# Altium schematic sheet Sensors_lib.SchDoc
size A
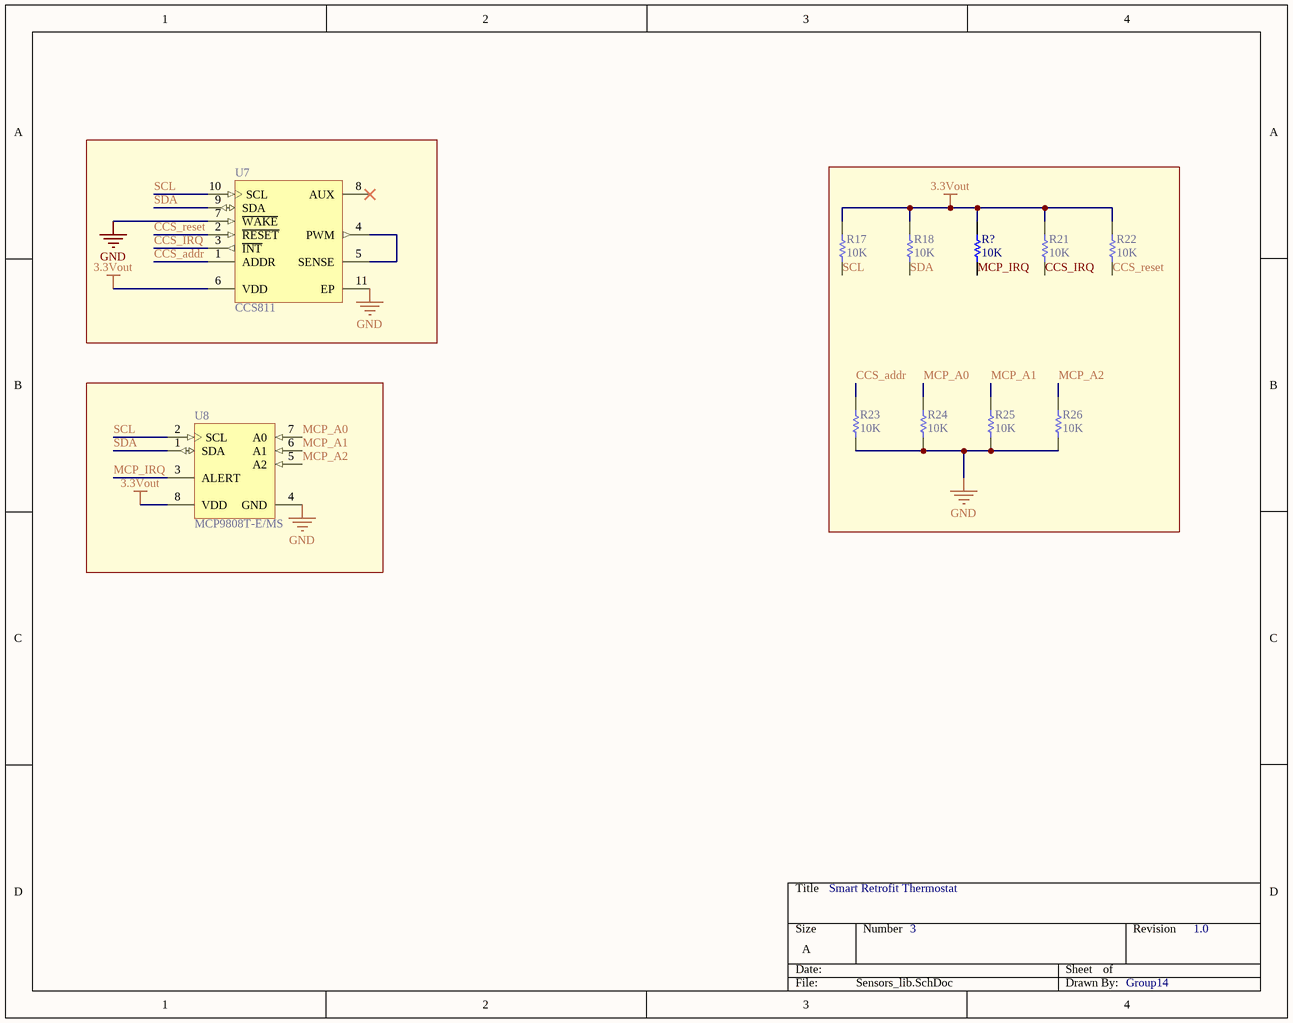
[diagram p0: Sensors_lib.SchDoc]

## Parts
R17  10K  [RESC0805(2012)_M]
R18  10K  [RESC0805(2012)_M]
R21  10K  [RESC0805(2012)_M]
R22  10K  [RESC0805(2012)_M]
R23  10K  [RESC0805(2012)_M]
R24  10K  [RESC0805(2012)_M]
R25  10K  [RESC0805(2012)_M]
R26  10K  [RESC0805(2012)_M]
R?  10K  [RESC0805(2012)_M]
U7  CCS811  [AMS-LGA-10_V]
U8  MCP9808T-E/MS  [MCHP-MSOP-MS8_M]

## Nets
3.3Vout: R17.2 R18.2 R21.2 R22.2 R?.2 U7.6(VDD) U8.8(VDD)
GND: R23.1 R24.1 R25.1 R26.1 U7.7(~{WAKE}) U7.11(EP) U8.4(GND)
CCS_addr: R23.2 U7.1(ADDR)
CCS_IRQ: R21.1 U7.3(~{INT})
CCS_reset: R22.1 U7.2(~{RESET})
MCP_A0: R24.2 U8.7(A0)
MCP_A1: R25.2 U8.6(A1)
MCP_A2: R26.2 U8.5(A2)
MCP_IRQ: R?.1 U8.3(ALERT)
SCL: R17.1 U7.10(SCL) U8.2(SCL)
SDA: R18.1 U7.9(SDA) U8.1(SDA)
NetU7_4: U7.4(PWM) U7.5(SENSE)

Not connected (* = marked no-connect by the designer): U7 8(AUX)*

## Notes on the sheet
- Smart Retrofit Thermostat
- 3
- 1.0
- Group14

## Library data of the parts
R17 R18 R21-R26 R? = CMP-1013-00623-1: 10K 0.125W 1% 0805 (2012 Metric)  SMD; Value: 10000.00 Ohm; Case-Metric: 2012; Case-EIA: 0805; Technology: SMT; Power: 0.125 W; Tolerance: 1 %
U7 = CMP-2000-07443-1: Ultra-Low Power Digital Gas Sensor for Monitoring Indoor Air Quality, 26 mA, 1.8 to 3.3 V, -5 to 50 degC, 10-Pin LGA, RoHS; Manufacturer: AMS; Package Description: 10-Pin Small Outline Non-lead, Body 4 x 2.7 mm, Pitch 0.6 mm; Datasheet URL: http://ams.com/eng/content/download/951091/2269479/471718; Manufacturer URL: http://www.ams.org/home/page; Datasheet Version: Rev. 1-02, 03/2017; Package Reference: LGA-10; RoHSCompliant: false; Mounting Technology: SurfaceMount
U8 = CMP-0192-00343-1: + / - 0.5 degC Maximum Accuracy Digital Temperature Sensor, 400 uA, 2.7 to 5.5 V, -40 to 125 degC, 8-pin MSOP (MS8), Tape and Reel; Manufacturer: Microchip; PackageVersion: C04-111C; ComponentLink1URL: http://www.microchip.com; ComponentLink2URL: http://ww1.microchip.com/downloads/en/DeviceDoc/25095A.pdf; PackageReference: MSOP-MS8; ComponentLink2Description: Datasheet; DatasheetVersion: Rev. A; ComponentLink1Description: Manufacturer URL; PackageDescription: 8-Lead Plastic Micro Small Outline Package, 3 x 3 mm Body, 0.65 mm Pitch; ComponentLink3Description: Package Specification; ComponentLink3URL: http://www.microchip.com/stellent/groups/techpub_sg/documents/packagingspec/en012702.pdf; PartNumber: MCP9808T-E/MS; ComponentLink4URL: http://www.microchip.com/MCP9808; ComponentLink4Description: Product URL; Mounting Technology: Surface Mount